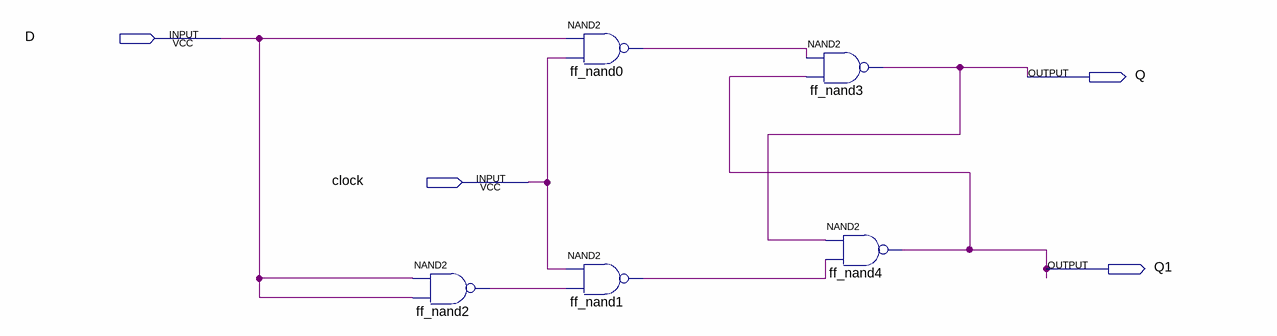
[diagram p0: schematic sheet]
// Quartus schematic flipflopD.bdf as structural Verilog: 5 symbols, 4 pins
module flipflopD (
  input  D,
  input  clock,
  output Q,
  output Q1
);

  wire ff_nand0_out, ff_nand1_out, ff_nand2_out;

  nand ff_nand2 (ff_nand2_out, D, D);
  nand ff_nand0 (ff_nand0_out, D, clock);
  nand ff_nand1 (ff_nand1_out, clock, ff_nand2_out);
  nand ff_nand3 (Q, ff_nand0_out, Q1);
  nand ff_nand4 (Q1, Q, ff_nand1_out);
endmodule
